# EAGLE design lfo (EAGLE 7.4.0)

## Sheet 1 of 2
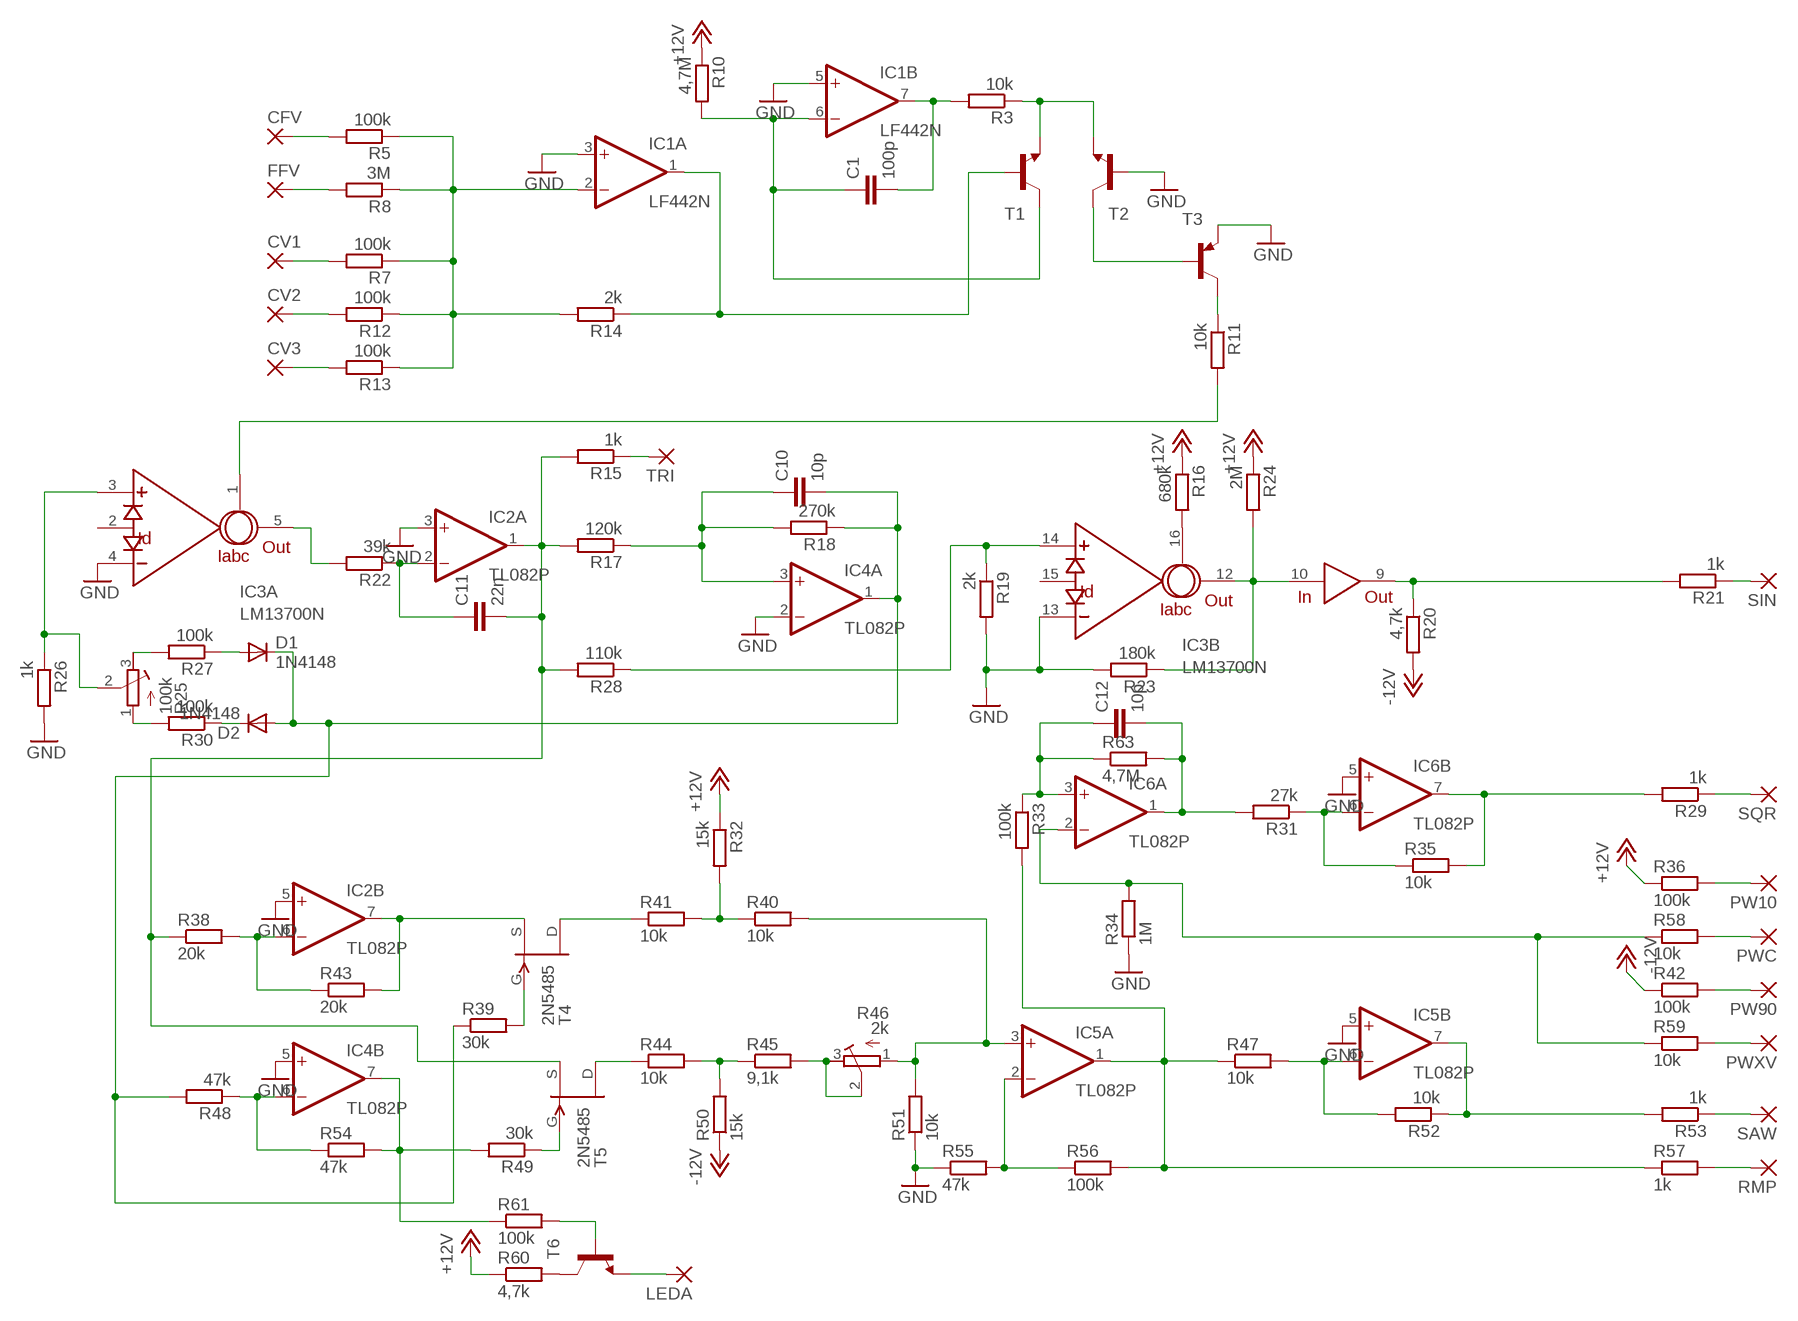
[diagram p0: schematic, sheet 1]

### Parts
C1  100p  C-EU050-035X075  [C050-035X075]
C10  10p  C-EU050-035X075  [C050-035X075]
C11  22n  C-EU050-035X075  [C050-035X075]
C12  10p  C-EU050-035X075  [C050-035X075]
CFV  2,54/1,0  [2,54/1,0]
CV1  2,54/1,0  [2,54/1,0]
CV2  2,54/1,0  [2,54/1,0]
CV3  2,54/1,0  [2,54/1,0]
D1  1N4148  1N4148DO35-7  [DO35-7]
D2  1N4148  1N4148DO35-7  [DO35-7]
FFV  2,54/1,0  [2,54/1,0]
IC1  LF442N  [DIL08]
IC2  TL082P  [DIL08]
IC3  LM13700N  [DIL16]
IC4  TL082P  [DIL08]
IC5  TL082P  [DIL08]
IC6  TL082P  [DIL08]
LEDA  2,54/1,0  [2,54/1,0]
PW10  2,54/1,0  [2,54/1,0]
PW90  2,54/1,0  [2,54/1,0]
PWC  2,54/1,0  [2,54/1,0]
PWXV  2,54/1,0  [2,54/1,0]
R3  10k  R-EU_0309/V  [0309V]
R5  100k  R-EU_0309/V  [0309V]
R7  100k  R-EU_0309/V  [0309V]
R8  3M  R-EU_0309/V  [0309V]
R10  4,7M  R-EU_0309/V  [0309V]
R11  10k  R-EU_0309/V  [0309V]
R12  100k  R-EU_0309/V  [0309V]
R13  100k  R-EU_0309/V  [0309V]
R14  2k  R-EU_0309/V  [0309V]
R15  1k  R-EU_0309/V  [0309V]
R16  680k  R-EU_0309/V  [0309V]
R17  120k  R-EU_0309/V  [0309V]
R18  270k  R-EU_0309/V  [0309V]
R19  2k  R-EU_0309/V  [0309V]
R20  4,7k  R-EU_0309/V  [0309V]
R21  1k  R-EU_0309/V  [0309V]
R22  39k  R-EU_0309/V  [0309V]
R23  180k  R-EU_0309/V  [0309V]
R24  2M  R-EU_0309/V  [0309V]
R25  100k  R-TRIMM64W  [RTRIM64W]
R26  1k  R-EU_0309/V  [0309V]
R27  100k  R-EU_0309/V  [0309V]
R28  110k  R-EU_0309/V  [0309V]
R29  1k  R-EU_0309/V  [0309V]
R30  100k  R-EU_0309/V  [0309V]
R31  27k  R-EU_0309/V  [0309V]
R32  15k  R-EU_0309/V  [0309V]
R33  100k  R-EU_0309/V  [0309V]
R34  1M  R-EU_0309/V  [0309V]
R35  10k  R-EU_0309/V  [0309V]
R36  100k  R-EU_0309/V  [0309V]
R38  20k  R-EU_0309/V  [0309V]
R39  30k  R-EU_0309/V  [0309V]
R40  10k  R-EU_0309/V  [0309V]
R41  10k  R-EU_0309/V  [0309V]
R42  100k  R-EU_0309/V  [0309V]
R43  20k  R-EU_0309/V  [0309V]
R44  10k  R-EU_0309/V  [0309V]
R45  9,1k  R-EU_0309/V  [0309V]
R46  2k  R-TRIMM64W  [RTRIM64W]
R47  10k  R-EU_0309/V  [0309V]
R48  47k  R-EU_0309/V  [0309V]
R49  30k  R-EU_0309/V  [0309V]
R50  15k  R-EU_0309/V  [0309V]
R51  10k  R-EU_0309/V  [0309V]
R52  10k  R-EU_0309/V  [0309V]
R53  1k  R-EU_0309/V  [0309V]
R54  47k  R-EU_0309/V  [0309V]
R55  47k  R-EU_0309/V  [0309V]
R56  100k  R-EU_0309/V  [0309V]
R57  1k  R-EU_0309/V  [0309V]
R58  10k  R-EU_0309/V  [0309V]
R59  10k  R-EU_0309/V  [0309V]
R60  4,7k  R-EU_0309/V  [0309V]
R61  100k  R-EU_0309/V  [0309V]
R63  4,7M  R-EU_0309/10  [0309/10]
RMP  2,54/1,0  [2,54/1,0]
SAW  2,54/1,0  [2,54/1,0]
SIN  2,54/1,0  [2,54/1,0]
SQR  2,54/1,0  [2,54/1,0]
T1  2N3904-NPN-TO92-EBC  [TO92-EBC]
T2  2N3904-NPN-TO92-EBC  [TO92-EBC]
T3  2N3906-PNP-TO92-EBC  [TO92-EBC]
T4  2N5485  [TO92-]
T5  2N5485  [TO92-]
T6  2N3904-NPN-TO92-EBC  [TO92-EBC]
TRI  2,54/1,0  [2,54/1,0]

### Nets
+12V: R10.1 R16.1 R24.1 R32.1 R36.1 R60.1 ; also sheet 2
-12V: R20.2 R42.1 R50.1 ; also sheet 2
GND: IC1.3(A:+IN) IC1.5(B:+IN) IC2.3(A:+IN) IC2.5(B:+IN) IC3.4(A:-IN) IC3.13(B:-IN) IC4.2(A:-IN) IC4.5(B:+IN) IC5.5(B:+IN) IC6.5(B:+IN) R19.2 R23.2 R26.2 R34.1 R51.1 R55.1 T2.B T3.E ; also sheet 2
N$1: FFV.1(P) R8.2
N$2: CFV.1(P) R5.2
N$4: IC1.1(A:OUT) R14.1 T1.B
N$5: CV1.1(P) R7.2
N$6: CV2.1(P) R12.2
N$7: CV3.1(P) R13.2
N$8: IC1.2(A:-IN) R5.1 R7.1 R8.1 R12.1 R13.1 R14.2
N$9: C1.1 IC1.6(B:-IN) R10.2 T1.C
N$10: C1.2 IC1.7(B:OUT) R3.2
N$11: R3.1 T1.E T2.E
N$12: T2.C T3.B
N$13: R11.1 T3.C
N$14: IC3.1(A:IABC) R11.2
N$15: IC3.3(A:+IN) R25.2(S) R26.1
N$16: IC3.14(B:+IN) R19.1 R28.1
N$17: R25.3(E) R27.2
N$18: R25.1(A) R30.2
N$19: D2.C R30.1
N$20: D1.A R27.1
N$21: C10.2 D1.C D2.A IC4.1(A:OUT) R18.1 R39.1 R48.2
N$22: IC3.5(A:OUT) R22.2
N$23: C11.1 IC2.2(A:-IN) R22.1
N$24: C11.2 IC2.1(A:OUT) R15.2 R17.2 R28.2 R38.1 T5.2(S)
N$25: C10.1 IC4.3(A:+IN) R17.1 R18.2
N$26: R15.1 TRI.1(P)
N$27: R21.1 SIN.1(P)
N$28: IC3.16(B:IABC) R16.2
N$29: IC3.10(IN) IC3.12(B:OUT) R23.1 R24.2
N$30: IC3.9(OUT) R20.1 R21.2
N$31: IC2.6(B:-IN) R38.2 R43.1
N$32: IC2.7(B:OUT) R43.2 T4.2(S)
N$33: IC4.6(B:-IN) R48.1 R54.1
N$34: IC4.7(B:OUT) R49.2 R54.2 R61.1
N$35: R39.2 T4.1(G)
N$36: R60.2 T6.C
N$37: R41.1 T4.3(D)
N$38: R32.2 R40.1 R41.2
N$39: IC5.3(A:+IN) R40.2 R46.1(A) R51.2
N$40: R49.1 T5.1(G)
N$41: R44.1 T5.3(D)
N$42: R44.2 R45.1 R50.2
N$43: R45.2 R46.2(S) R46.3(E)
N$44: R61.2 T6.B
N$45: LEDA.1(P) T6.E
N$46: IC5.2(A:-IN) R55.2 R56.1
N$47: IC5.1(A:OUT) R33.2 R47.1 R56.2 R57.1
N$48: R57.2 RMP.1(P)
N$49: C12.2 IC6.1(A:OUT) R31.2 R63.2
N$50: C12.1 IC6.3(A:+IN) R33.1 R63.1
N$51: PWXV.1(P) R59.2
N$52: IC6.2(A:-IN) R34.2 R58.1 R59.1
N$53: PW90.1(P) R42.2
N$54: PWC.1(P) R58.2
N$55: PW10.1(P) R36.2
N$56: IC6.6(B:-IN) R31.1 R35.1
N$57: IC6.7(B:OUT) R29.2 R35.2
N$58: R29.1 SQR.1(P)
N$59: IC5.6(B:-IN) R47.2 R52.2
N$60: IC5.7(B:OUT) R52.1 R53.2
N$61: R53.1 SAW.1(P)
Unconnected: IC3.2(A:ID) IC3.7(IN) IC3.8(OUT) IC3.15(B:ID)

## Sheet 2 of 2
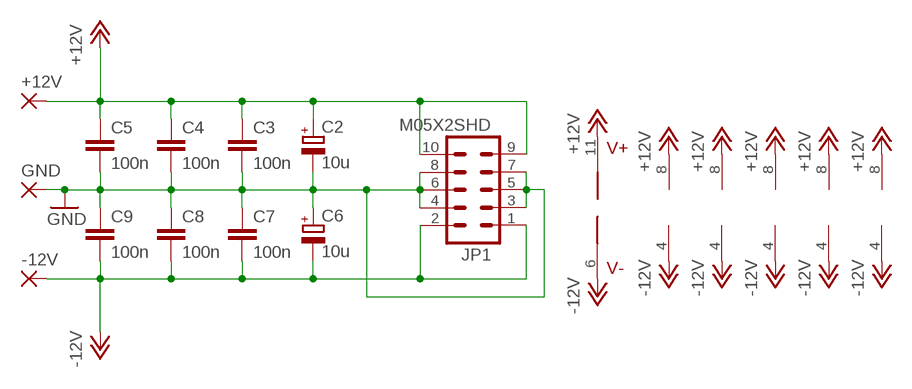
[diagram p1: schematic, sheet 2]

### Parts
+12V  2,54/1,0  [2,54/1,0]
-12V  2,54/1,0  [2,54/1,0]
C2  10u  CPOL-EUE3.5-8  [E3,5-8]
C3  100n  C-EU050-035X075  [C050-035X075]
C4  100n  C-EU050-035X075  [C050-035X075]
C5  100n  C-EU050-035X075  [C050-035X075]
C6  10u  CPOL-EUE3.5-8  [E3,5-8]
C7  100n  C-EU050-035X075  [C050-035X075]
C8  100n  C-EU050-035X075  [C050-035X075]
C9  100n  C-EU050-035X075  [C050-035X075]
GND  2,54/1,0  [2,54/1,0]
JP1  M05X2SHD  [2X5-SHROUDED]

### Nets
+12V: +12V.1(P) C2.+ C3.1 C4.1 C5.1 IC1.8(P:V+) IC2.8(P:V+) IC3.11(V+) IC4.8(P:V+) IC5.8(P:V+) IC6.8(P:V+) JP1.9 JP1.10 ; also sheet 1
-12V: -12V.1(P) C6.- C7.2 C8.2 C9.2 IC1.4(P:V-) IC2.4(P:V-) IC3.6(V-) IC4.4(P:V-) IC5.4(P:V-) IC6.4(P:V-) JP1.1 JP1.2 ; also sheet 1
GND: C2.- C3.2 C4.2 C5.2 C6.+ C7.1 C8.1 C9.1 GND.1(P) JP1.3 JP1.4 JP1.5 JP1.6 JP1.7 JP1.8 ; also sheet 1

## Library data of the parts
+12V -12V CFV CV1-CV3 FFV GND LEDA PW10 PW90 PWC PWXV RMP SAW SIN SQR TRI = wirepad:2,54/1,0: THROUGH-HOLE PAD
C1 C3-C5 C7-C12 = rcl:C-EU: CAPACITOR, European symbol
C2 C6 = rcl:CPOL-EU: POLARIZED CAPACITOR, European symbol
D1 D2 = diode:1N4148: DIODE high speed (Philips)
IC1 = cavalier:LF442: OP AMP
IC2 IC4-IC6 = cavalier:TL082: OP AMP
IC3 = synthdiy:LM13700: National Dual OTA with buffers.
JP1 = SparkFun:M05X2: Header 5x2 Standard 10-pin dual row 0.1" header. Commonly used with AVR-ISP. Use with Spark Fun Electronics SKU: PRT-00778
R3 R5 R7 R8 R10-R24 R26-R36 R38-R45 R47-R61 R63 = rcl:R-EU_: RESISTOR, European symbol
R25 R46 = rcl:R-TRIMM: Trimm resistor
T1 T2 T6 = transistor-neu-to92:*-NPN-: NPN Transistror
T3 = transistor-neu-to92:*-PNP-: PNP Transistror
T4 T5 = transistor-fet:?548*: N-Channel JFETs Source: VISHAY 2N5484.pdf Compatible: TO92 2N5245 J304 J305 U310 J308 J309 J310 TO72 2N4416 2N4416A 2N3823 2N4351 3N169 3N170 3N171 MFE3002 TO18 2N3796 2N3797 MFE825 Source: Motorola European Master Guide Pacge 3-59

## Board
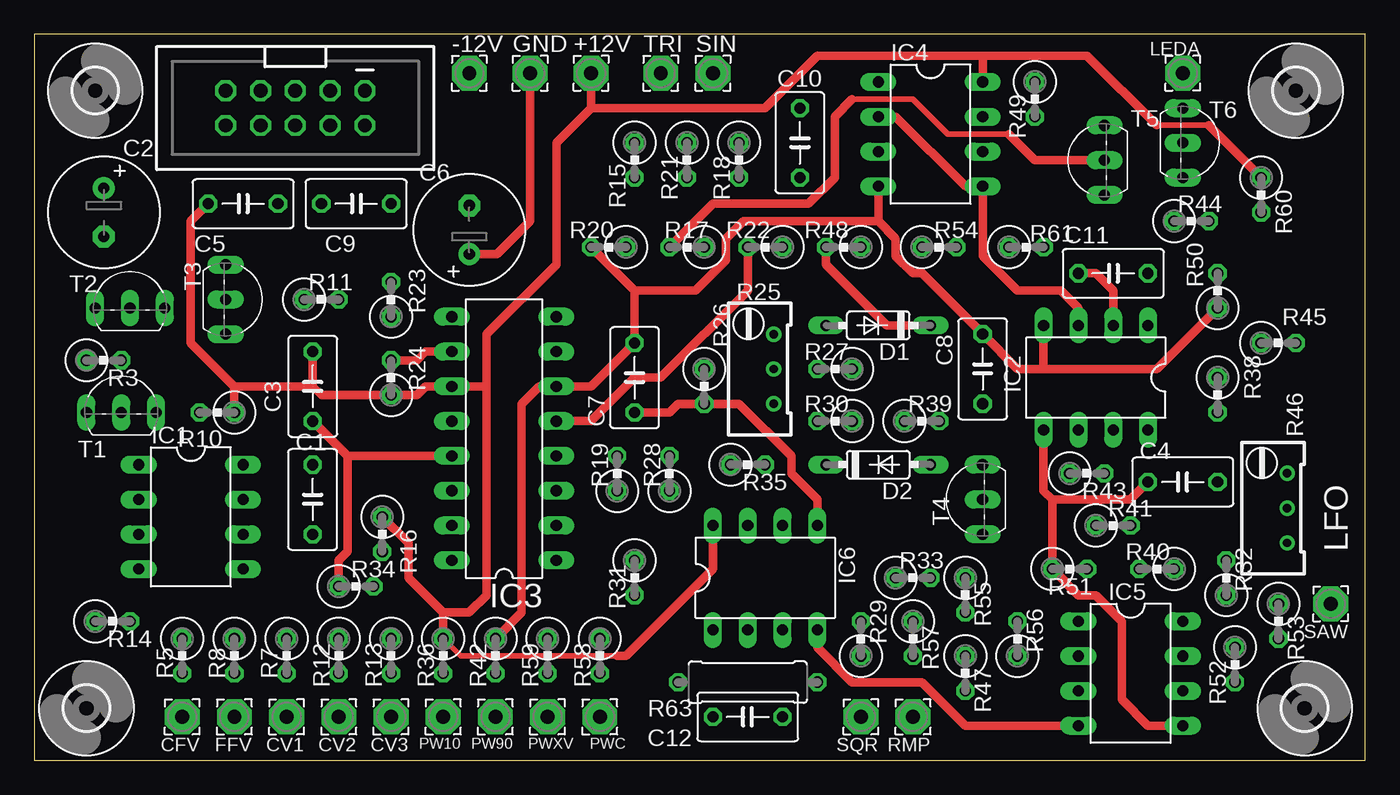
[diagram p2: board, top side]
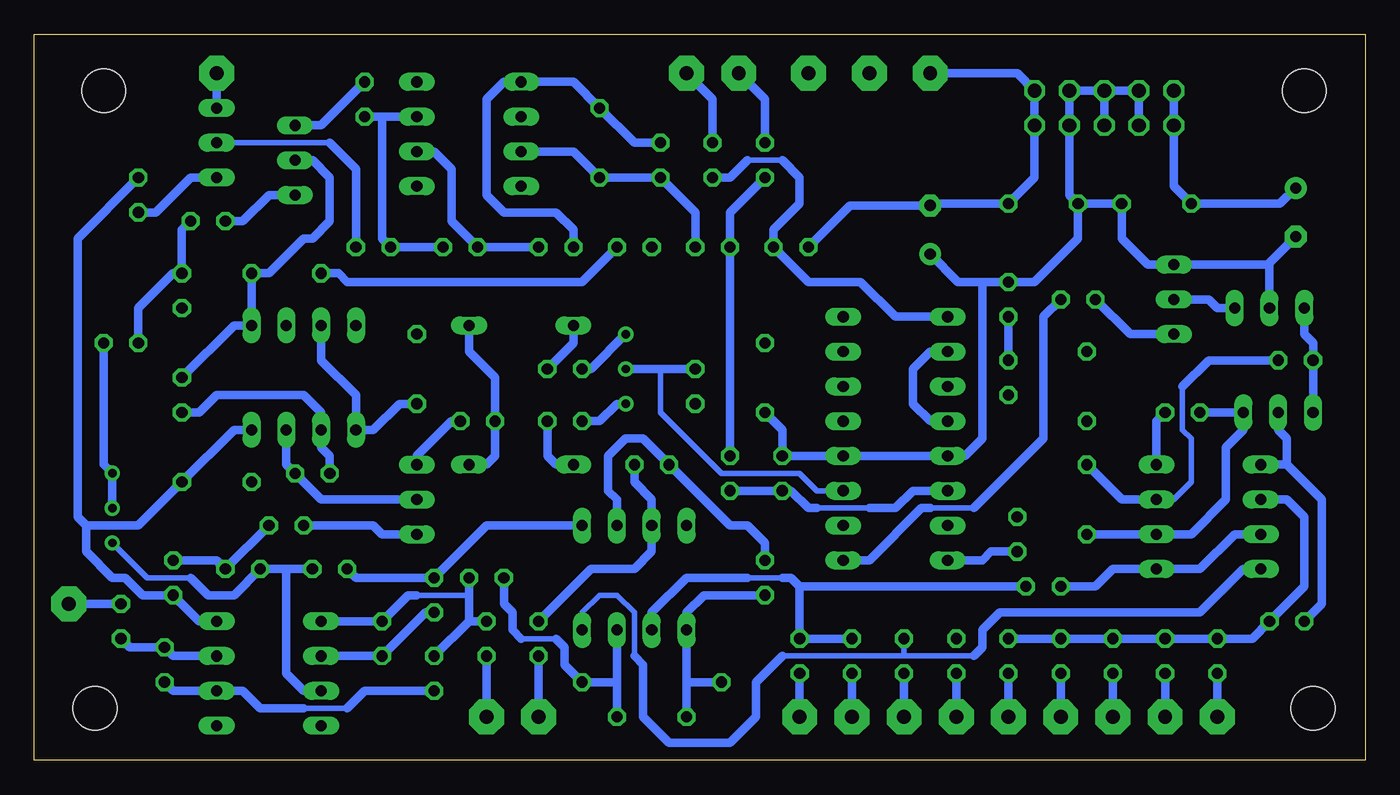
[diagram p3: board, bottom side, seen from below]

Size 97.14 x 53.01 mm. Coordinates in mm from the lower left corner, seen from the top.
Outline: 0,0 97.14,0 97.14,53.01 0,53.01 0,0
Copper layers (1*16): Top 0.035mm / dielectric 1.5mm / Bottom 0.035mm
Design rules "default": minimum track width 10mil, minimum drill 24mil, track to track 8mil, track to pad 8mil, pad to pad 8mil, via to via 8mil, smd to smd 8mil, copper to edge 40mil, drill to drill 8mil, minimum pad ring 10mil, minimum via ring 8mil, stop-mask expansion 4mil, vias tented up to drill 0mil, thermal gap 10mil

### Footprints (pad centres in the part's own frame; a part is rotated, then mirrored left to right if it is on the bottom)
2,54/1,0 = drill 1.016 pad 2.54 octagon: 1 0,0
C050-035X075 = drill 0.813 octagon: 1 -2.54,0; 2 2.54,0
E3,5-8 = drill 0.813 pad 1.6: + -1.778,0 | drill 0.813 pad 1.6 octagon: - 1.778,0
DO35-7 = drill 0.813 long: A 3.81,0; C -3.81,0
DIL08 = drill 0.813 pad 1.27 long: 1 -3.81,-3.81; 2 -1.27,-3.81; 3 1.27,-3.81; 4 3.81,-3.81; 5 3.81,3.81; 6 1.27,3.81; 7 -1.27,3.81; 8 -3.81,3.81
DIL16 = drill 0.813 long: 1 -8.89,-3.81; 2 -6.35,-3.81; 3 -3.81,-3.81; 4 -1.27,-3.81; 5 1.27,-3.81; 6 3.81,-3.81; 7 6.35,-3.81; 8 8.89,-3.81; 9 8.89,3.81; 10 6.35,3.81; 11 3.81,3.81; 12 1.27,3.81; 13 -1.27,3.81; 14 -3.81,3.81; 15 -6.35,3.81; 16 -8.89,3.81
2X5-SHROUDED = drill 1.016 octagon: 1 -1.27,5.08; 2 1.27,5.08; 3 -1.27,2.54; 4 1.27,2.54; 5 -1.27,0; 6 1.27,0; 7 -1.27,-2.54; 8 1.27,-2.54; 9 -1.27,-5.08; 10 1.27,-5.08
0309V = drill 0.813 octagon: 1 -1.27,0; 2 1.27,0
RTRIM64W = drill 0.61: 1 1.27,-2.54; 2 1.27,0; 3 1.27,2.54
0309/10 = drill 0.813 octagon: 1 -5.08,0; 2 5.08,0
TO92-EBC = drill 0.813 long: B 0,-1.27; C 2.54,-1.27; E -2.54,-1.27
TO92- = drill 0.813 long: 1 2.54,0; 2 0,0; 3 -2.54,0
3,2 = hole 3.2: 0,0

### Placement (x,y rotation side)
+12V  40.64,50.16 0 top
-12V  31.75,50.16 0 top
C1  20.32,19.05 90 top
C2  5.08,40.01 270 top
C3  20.32,27.3 270 top
C4  83.82,20.32 180 top
C5  15.24,40.64 0 top
C6  31.75,38.73 90 top
C7  43.81,27.94 90 top
C8  69.22,28.57 90 top
C9  23.5,40.64 0 top
C10  55.88,45.09 90 top
C11  78.74,35.56 0 top
C12  52.07,3.17 180 top
CFV  10.79,3.17 90 top
CV1  18.41,3.17 90 top
CV2  22.23,3.17 90 top
CV3  26.04,3.17 90 top
D1  61.59,31.75 180 top
D2  61.59,21.59 0 top
FFV  14.61,3.17 90 top
GND  36.2,50.16 0 top
IC1  11.43,17.78 270 top
IC2  77.47,27.94 180 top
IC3  34.29,23.5 90 top
IC4  65.41,45.72 270 top
IC5  80.01,6.35 270 top
IC6  53.34,13.34 0 top
JP1  19.05,47.62 270 top
LEDA  83.82,50.16 90 top
PW10  29.84,3.17 90 top
PW90  33.66,3.17 90 top
PWC  41.27,3.17 90 top
PWXV  37.47,3.17 90 top
R3  5.08,29.21 0 top
R5  10.79,7.62 270 top
R7  18.41,7.62 270 top
R8  14.61,7.62 270 top
R10  13.34,25.4 180 top
R11  20.95,33.66 0 top
R12  22.23,7.62 270 top
R13  26.04,7.62 270 top
R14  5.71,10.16 0 top
R15  43.81,43.81 270 top
R16  25.4,16.51 270 top
R17  47.62,37.47 180 top
R18  51.44,43.81 270 top
R19  42.55,20.95 90 top
R20  41.91,37.47 180 top
R21  47.62,43.81 270 top
R22  53.34,37.47 180 top
R23  26.04,33.66 90 top
R24  26.04,27.94 90 top
R25  52.7,28.57 0 top
R26  48.9,27.3 270 top
R27  58.42,28.57 180 top
R28  46.35,20.95 90 top
R29  60.33,8.89 90 top
R30  58.42,24.77 180 top
R31  43.81,13.34 270 top
R32  87,13.34 90 top
R33  64.14,13.34 0 top
R34  23.5,12.7 0 top
R35  52.07,21.59 0 top
R36  29.84,7.62 270 top
R38  86.36,26.67 270 top
R39  64.77,24.77 0 top
R40  81.92,13.97 180 top
R41  78.74,17.14 0 top
R42  33.66,7.62 270 top
R43  76.83,20.95 0 top
R44  84.45,39.37 0 top
R45  90.81,30.48 0 top
R46  90.17,18.41 0 top
R47  67.94,6.35 270 top
R48  59.05,37.47 180 top
R49  73.03,48.26 270 top
R50  86.36,34.29 90 top
R51  75.56,13.97 0 top
R52  87.63,6.99 270 top
R53  90.81,10.16 270 top
R54  66.04,37.47 0 top
R55  67.94,12.06 270 top
R56  71.75,8.89 90 top
R57  64.14,8.89 270 top
R58  41.27,7.62 270 top
R59  37.47,7.62 270 top
R60  89.53,41.27 270 top
R61  72.39,37.47 0 top
R63  52.07,5.71 180 top
RMP  64.14,3.17 90 top
SAW  94.61,11.43 90 top
SIN  49.53,50.16 0 top
SQR  60.33,3.17 90 top
T1  6.35,26.67 0 top
T2  6.99,34.29 0 top
T3  15.24,33.66 270 top
T4  69.22,19.05 90 top
T5  78.11,43.81 90 top
T6  85.09,45.09 270 top
TRI  45.72,50.16 0 top
U$1  [3,2]  3.81,3.81 0 top
U$2  [3,2]  92.71,3.81 0 top
U$3  [3,2]  4.45,48.9 0 top
U$4  [3,2]  92.08,48.9 0 top

### Tracks (layer width: path | path; a pad name or v marks a point on that pad's centre or on a via)
+12V
  Top 0.406: R36.1 31.11,7.62 42.55,7.62 | 85.72,46.35 81.92,46.35
  Top 0.61: R16.1 27.3,15.88 27.3,13.34 29.84,10.79 | IC6.8 49.53,13.97 43.18,7.62 42.55,7.62 | R36.1 29.84,10.79 | 40.64,47.62 38.1,45.09 38.1,36.2 33.02,31.11 33.02,27.3 | 20.32,27.3 20.95,26.67 R24.1 27.94,26.67 28.57,27.3 IC3.11 33.02,27.3 | 20.32,27.3 14.61,27.3 | 14.61,27.3 R10.1 | C3.1 20.32,27.3 | C5.1 11.43,39.37 11.43,30.48 14.61,27.3 | 33.02,27.3 33.02,12.06 31.75,10.79 29.84,10.79 | +12V.1 40.64,47.62 | 40.64,47.62 53.34,47.62 57.15,51.44 69.22,51.44 | 69.22,51.44 IC4.8 | R60.1 85.72,46.35 | 81.92,46.35 76.83,51.44 69.22,51.44
  Bottom 0.61: IC1.8 15.24,24.77 R10.1 | JP1.9 JP1.10 | 13.97,45.72 JP1.10 | JP1.10 13.97,41.91 C5.1 6.22,40.64 C2.+ | IC5.8 85.09,10.16 R32.1 89.22,12.06 90.49,13.34 91.44,13.34 93.34,15.24 93.34,17.14 | 93.34,17.14 89.53,17.14 C4.1 82.55,24.13 IC2.8 | R60.1 93.98,38.1 93.98,17.78 93.34,17.14
-12V
  Top 0.61: R42.1 35.56,10.79 35.56,26.04 36.83,27.3 IC3.6 40.64,27.3 C7.2 43.81,34.29 | IC6.4 57.15,8.26 59.69,5.71 64.77,5.71 67.94,2.54 IC5.4 | R20.2 43.81,34.29 | 43.81,34.29 48.26,34.29 50.48,36.51 50.48,38.1 51.75,39.37 61.59,39.37 | 73.66,28.57 71.75,28.57 C8.2 64.77,35.56 64.14,35.56 62.87,36.83 62.87,38.1 61.59,39.37 | 73.66,28.57 81.92,28.57 R50.1 | IC2.4 73.66,28.57 | IC4.4 61.59,39.37
  Bottom 0.406: 28.57,7.62 33.66,7.62 | 33.66,7.62 42.55,7.62 | 53.34,7.62 53.34,10.79 54.61,12.06 55.88,12.06 57.15,10.79 IC6.4 | R42.1 33.66,7.62
  Bottom 0.61: -12V.1 25.4,50.16 JP1.1 JP1.2 24.13,42.55 C9.2 31.62,40.64 C6.- 37.59,40.51 R20.2 | IC1.4 8.89,13.97 12.06,10.79 26.67,10.79 27.94,9.53 27.94,8.26 28.57,7.62 | 42.55,7.62 44.45,5.71 44.45,3.17 46.35,1.27 50.8,1.27 52.7,3.17 52.7,6.99 53.34,7.62
GND
  Top 0.61: C6.+ 33.78,36.96 36.2,39.37 GND.1 | IC3.13 22.86,22.23 | C3.2 22.86,22.23 | 22.86,22.23 22.86,15.24 22.23,14.61 R34.1 | C7.1 46.35,25.4 46.99,26.04 R26.2 51.44,26.04 55.24,22.23 55.24,20.95 57.15,19.05 IC6.5 | IC5.5 81.28,2.54 79.38,4.45 79.38,10.16 77.47,12.06 76.2,12.06 R51.1 74.3,19.05 | 74.3,19.05 73.66,19.68 IC2.5 | C4.2 80.01,19.05 74.3,19.05 | IC4.2 62.87,46.99 67.94,41.91 IC4.5 69.22,36.83 71.75,34.29 74.93,34.29 76.2,33.02 IC2.3
  Bottom 0.61: IC1.3 9.53,16.51 12.06,13.97 IC1.5 18.41,13.97 19.68,12.7 R34.1 | JP1.8 JP1.7 JP1.5 | JP1.6 JP1.5 | JP1.5 JP1.3 JP1.4 21.59,41.27 C9.1 | C9.1 C5.2 17.78,38.1 15.88,36.2 T3.E 7.11,36.2 | 7.11,36.2 C2.- | T2.B 6.99,36.07 7.11,36.2 | C8.1 70.48,26.04 72.39,24.13 IC2.5 73.66,26.67 76.2,29.21 IC2.3 | C7.1 42.55,24.13 R19.2 IC3.4 IC3.13 29.21,22.23 27.94,23.5 27.94,34.92 | C9.1 20.95,38.1 24.13,34.92 R23.2 27.94,34.92 | 27.94,34.92 29.72,34.92 C6.+ | IC6.5 64.14,17.14 R55.1 73.66,13.34 R51.1
N$1
  Bottom 0.61: FFV.1 R8.2
N$2
  Bottom 0.61: CFV.1 R5.2
N$4
  Bottom 0.61: R14.1 3.17,11.43 3.17,19.05 5.71,21.59 | 5.71,21.59 IC1.1 | T1.B 6.35,24.13 5.71,23.5 5.71,21.59
N$5
  Bottom 0.61: CV1.1 R7.2
N$6
  Bottom 0.61: CV2.1 R12.2
N$7
  Bottom 0.61: CV3.1 R13.2
N$8
  Bottom 0.61: R13.1 R12.1 R7.1 R8.1 R5.1 8.26,8.89 R14.2 4.45,12.7 4.45,17.78 5.71,19.05 IC1.2
N$9
  Bottom 0.61: C1.1 IC1.6 12.7,16.51 10.16,19.05 10.16,22.86 8.89,24.13 T1.C R10.2
N$10
  Bottom 0.406: 13.34,27.3 13.34,24.13 12.7,23.5 12.7,20.32 13.97,19.05 IC1.7
  Bottom 0.61: R3.2 11.43,29.21 13.34,27.3 | IC1.7 17.78,19.05 C1.2
N$11
  Bottom 0.61: T1.E R3.1 3.81,30.48 4.45,31.11 T2.E
N$12
  Bottom 0.61: T3.B 11.43,33.66 10.79,33.02 T2.C
N$13
  Bottom 0.61: T3.C 17.14,31.11 R11.1
N$14
  Bottom 0.406: 28.57,18.41 31.75,18.41
  Bottom 0.61: R11.2 23.5,32.38 23.5,23.5 28.57,18.41 | 31.75,18.41 32.38,18.41 36.2,14.61 IC3.1
N$15
  Bottom 0.406: IC3.3 40.01,19.68 41.27,20.95 46.99,20.95 51.44,25.4 51.44,28.57
  Bottom 0.61: R25.2 51.44,28.57 R26.1
N$16
  Bottom 0.406: 40.01,18.41 36.2,18.41
  Bottom 0.61: R28.1 R19.1 41.91,19.68 40.64,18.41 40.01,18.41 | 36.2,18.41 34.29,18.41 33.02,19.68 IC3.14
N$17
  Bottom 0.61: R27.2 56.52,28.57 R25.3
N$18
  Bottom 0.61: R25.1 54.61,26.04 55.88,24.77 R30.2
N$19
  Bottom 0.61: R30.1 59.69,22.23 59.05,21.59 D2.C
N$20
  Bottom 0.61: D1.A 57.78,30.48 R27.1
N$21
  Top 0.61: D1.C 62.23,31.75 57.78,36.2 R48.2
  Bottom 0.61: R18.1 53.34,45.09 C10.2 57.78,49.53 IC4.1 62.87,49.53 64.14,48.26 64.14,41.27 62.87,40.01 59.05,40.01 57.78,38.73 R48.2 | D2.A 64.14,21.59 63.5,22.23 R39.1 63.5,27.94 65.41,29.84 D1.C
N$22
  Top 0.61: IC3.5 40.64,24.77 43.81,27.94 45.72,27.94 52.07,34.29 R22.2
N$23
  Top 0.61: C11.1 77.47,35.56 78.74,34.29 IC2.2
  Bottom 0.61: R22.1 57.15,34.92 74.3,34.92 74.93,35.56 C11.1
N$24
  Top 0.406: 59.69,48.26 64.14,48.26 66.67,45.72 71.12,45.72
  Top 0.61: R17.2 49.53,40.64 56.52,40.64 58.42,42.55 58.42,46.99 59.69,48.26 | 71.12,45.72 73.03,43.81 T5.2
  Bottom 0.61: R38.1 82.55,31.75 IC2.1 C11.2 80.01,35.56 77.47,38.1 76.83,38.1 75.56,39.37 75.56,42.55 76.83,43.81 T5.2 | R28.2 R17.2 46.35,40.01 R15.2
N$25
  Bottom 0.61: R17.1 48.9,40.01 R18.2 C10.1 57.78,44.45 IC4.3
N$26
  Bottom 0.61: R15.1 43.81,48.26 TRI.1
N$27
  Bottom 0.61: R21.1 47.62,48.26 SIN.1
N$28
  Bottom 0.61: R16.2 27.3,15.24 27.94,14.61 IC3.16
N$29
  Top 0.61: R24.2 27.94,29.21 28.57,29.84 IC3.10
  Bottom 0.61: R23.1 R24.2 | IC3.10 31.75,29.84 33.02,28.57 33.02,26.04 31.75,24.77 IC3.12
N$30
  Bottom 0.406: 45.09,43.81 42.55,43.81
  Bottom 0.61: R21.2 46.35,42.55 45.09,43.81 | 42.55,43.81 41.27,42.55 41.27,40.64 43.18,38.73 R20.1 40.64,34.92 36.83,34.92 34.29,32.38 IC3.9
N$31
  Bottom 0.61: R43.1 75.56,22.23 76.2,22.86 IC2.6 76.2,25.4 77.47,26.67 83.82,26.67 85.09,25.4 R38.2
N$32
  Bottom 0.61: T4.2 76.2,19.05 R43.2 78.74,21.59 IC2.7
N$33
  Bottom 0.61: R48.1 R54.1 66.67,39.37 66.67,43.18 67.94,44.45 IC4.6
N$34
  Bottom 0.61: IC4.7 71.75,46.99 | 71.75,46.99 R49.2 | R54.2 R61.1 71.75,38.1 71.75,46.99
N$35
  Bottom 0.61: R39.2 66.67,24.77 69.22,22.23 T4.1
N$36
  Bottom 0.61: T6.C 85.72,42.55 88.27,40.01 R60.2
N$37
  Bottom 0.61: T4.3 71.75,16.51 72.39,17.14 R41.1
N$38
  Bottom 0.61: R41.2 R40.1 83.82,14.61 R32.2
N$39
  Bottom 0.406: 85.72,13.34 88.9,13.34 R46.1
  Bottom 0.61: 85.72,13.34 84.45,12.06 82.55,12.06 R40.2 78.74,13.97 | IC5.3 77.47,5.08 78.74,6.35 78.74,13.97 | 78.74,13.97 R51.2
N$40
  Bottom 0.61: R49.1 76.2,46.35 T5.1
N$41
  Bottom 0.61: T5.3 80.01,41.27 81.92,39.37 R44.1
N$42
  Bottom 0.61: R44.2 86.36,38.73 R50.2 87,35.56 89.53,33.02 R45.1
N$43
  Bottom 0.61: R45.2 92.08,21.59 R46.3 R46.2
N$44
  Bottom 0.406: 75.56,45.09 T6.B
  Bottom 0.61: 75.56,45.09 73.66,43.18 R61.2
N$45
  Bottom 0.61: T6.E LEDA.1
N$46
  Bottom 0.61: IC5.2 R56.1 68.58,10.79 R55.2
N$47
  Bottom 0.406: 69.22,12.06 65.41,12.06
  Bottom 0.61: IC5.1 R56.2 69.85,12.06 69.22,12.06 | R33.2 65.41,12.06 65.41,10.16 | R47.1 65.41,10.16 | 65.41,10.16 R57.1
N$48
  Bottom 0.61: RMP.1 R57.2
N$49
  Bottom 0.61: C12.2 49.53,5.71 | 49.53,5.71 IC6.1 49.53,10.79 48.26,12.06 R31.2 | R63.2 49.53,5.71
N$50
  Bottom 0.406: 61.59,8.89 59.05,8.89
  Bottom 0.61: R33.1 62.87,11.43 62.23,10.79 62.23,9.53 61.59,8.89 | 59.05,8.89 58.42,8.26 58.42,6.99 R63.1 54.61,5.71 | IC6.3 54.61,5.71 | 54.61,5.71 C12.1
N$51
  Bottom 0.61: PWXV.1 R59.2
N$52
  Bottom 0.406: 42.55,13.34 45.09,13.34
  Bottom 0.61: R34.2 41.27,12.7 | 41.27,12.7 41.91,13.34 42.55,13.34 | 45.09,13.34 49.53,13.34 52.07,10.79 IC6.2 | 41.27,12.7 R58.1 R59.1
N$53
  Bottom 0.61: PW90.1 R42.2
N$54
  Bottom 0.61: PWC.1 R58.2
N$55
  Bottom 0.61: PW10.1 R36.2
N$56
  Bottom 0.61: R31.1 43.81,15.88 45.09,17.14 46.35,17.14 R35.1 52.7,23.5 53.98,23.5 55.24,22.23 55.24,19.68 54.61,19.05 IC6.6
N$57
  Bottom 0.61: R35.2 53.34,20.32 52.07,19.05 IC6.7 52.07,15.24 53.34,13.97 56.52,13.97 R29.2
N$58
  Bottom 0.61: SQR.1 R29.1
N$59
  Bottom 0.406: 74.3,3.81 77.47,3.81
  Bottom 0.61: R52.2 87,5.08 IC5.6 81.92,5.08 80.64,3.81 77.47,3.81 | R47.2 73.03,5.08 74.3,3.81
N$60
  Bottom 0.61: IC5.7 87,7.62 R52.1 90.17,8.26 R53.2
N$61
  Bottom 0.61: SAW.1 R53.1

### Text on the board
tPlace: LFO